# Altium schematic sheet CPCIS_Connectors.SchDoc
size 420 x 297 mm; SheetNumber: 3; SPICEModelCacheWWJYHNFZ: <root> / <DocumentId>WWJYHNFZ</DocumentId> / </root>; Title2: CPCIS_Connectors
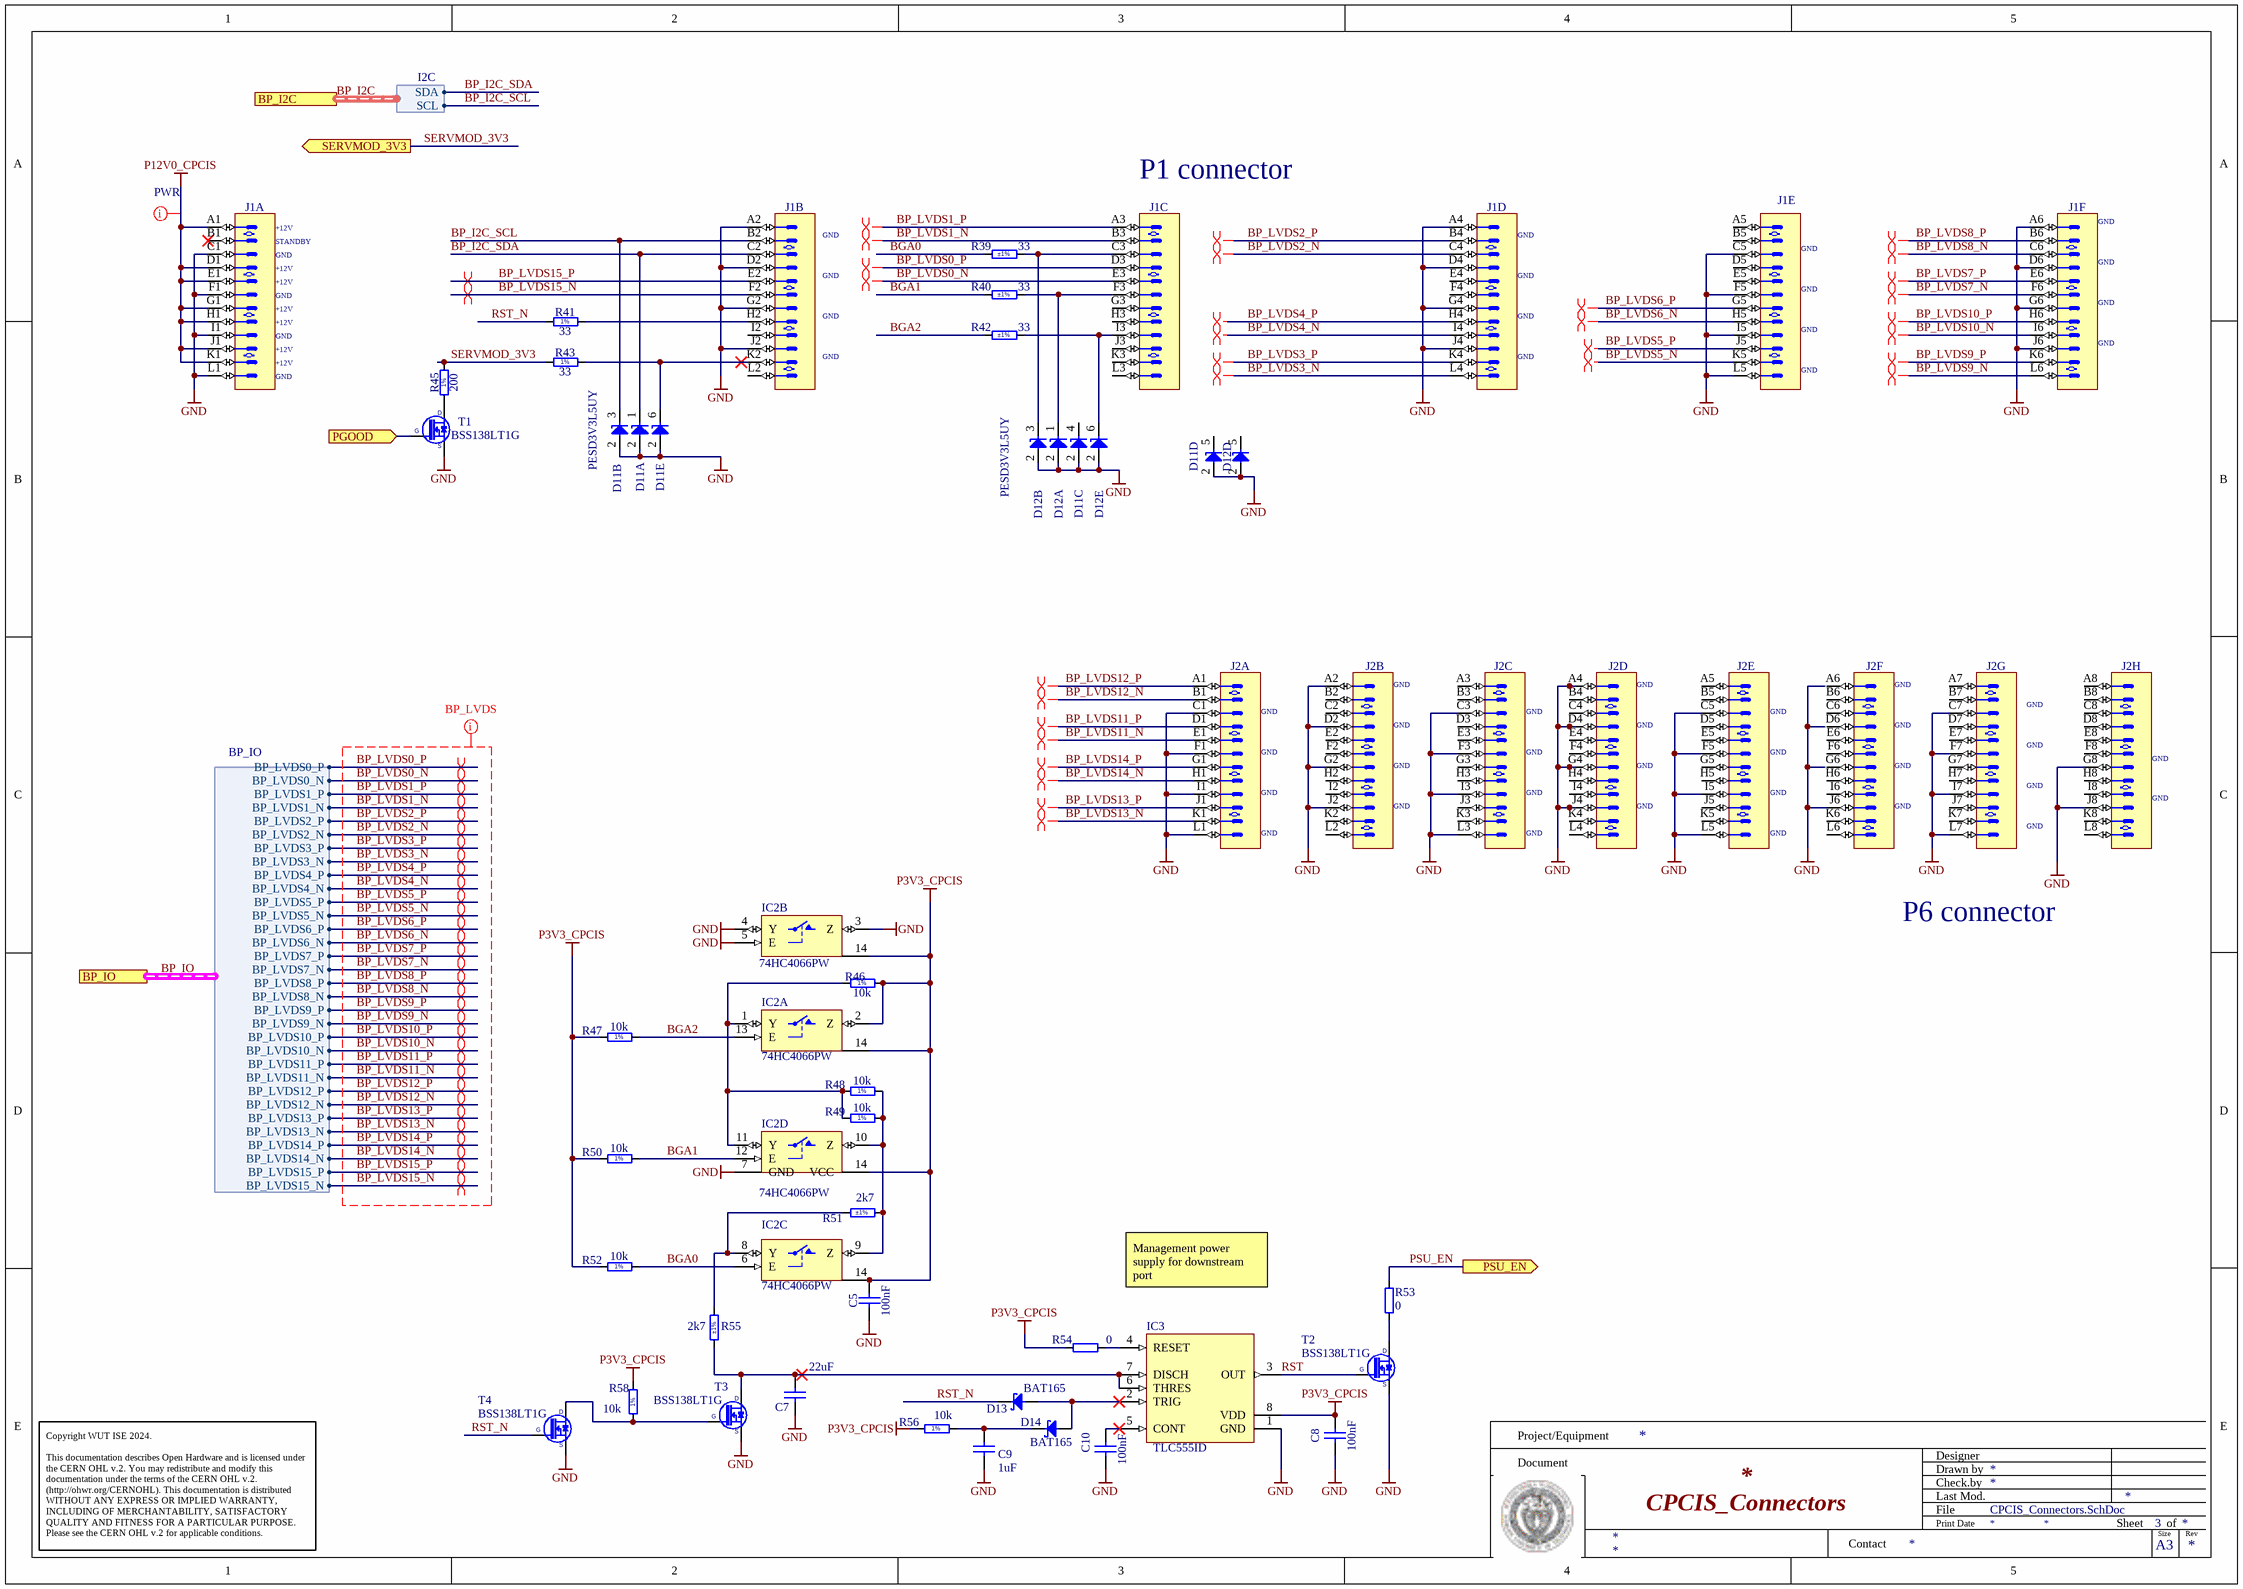
[diagram p0: CPCIS_Connectors.SchDoc]

## Parts
C5  100nF  [CAPC1005X55N]
C7  22uF  [CAPC2012X135N]
C8  100nF  [CAPC1005X55N]
C9  1uF  [CAPC1608X87N]
C10  100nF  [CAPC1005X55N]
D11  PESD3V3L5UY  [SOT65P210X110-6N]  (value not drawn)  (parts A,B,C,D,E of 5)
D12  PESD3V3L5UY  [SOT65P210X110-6N]  (value not drawn)  (parts A,B,D,E of 5)
D13  BAT165  [SOD2512X110N]
D14  BAT165  [SOD2512X110N]
IC2  74HC4066PW  [SOP65P640X110-14N]  (parts A,B,C,D of 4)
IC3  TLC555ID  [SOIC127P600X175-8N]
J1  (no value)  [AMPHENOL_10052825-101LF]  (parts A,B,C,D,E,F of 6)
J2  (no value)  [AMPHENOL_10052838-101LF]  (parts A,B,C,D,E,F,G,H of 8)
R39  33  Tolerance: ±1%  [RESC1608X55N]
R40  33  Tolerance: ±1%  [RESC1608X55N]
R41  33  Tolerance: 1%  [RESC1005X40N]
R42  33  Tolerance: ±1%  [RESC1608X55N]
R43  33  Tolerance: 1%  [RESC1005X40N]
R45  200  [RESC1005X40N]
R46  10k  [RESC1005X40N]
R47  10k  [RESC1005X40N]
R48  10k  [RESC1005X40N]
R49  10k  [RESC1005X40N]
R50  10k  [RESC1005X40N]
R51  2k7  Tolerance: ±1%  [RESC1608X55N]
R52  10k  [RESC1005X40N]
R53  0  [RESC1005X35N]
R54  0  [RESC1005X35N]
R55  2k7  Tolerance: ±1%  [RESC1608X55N]
R56  10k  [RESC1005X40N]
R58  10k  [RESC1005X40N]
T1  BSS138LT1G  [SOT95P240X110-3N]
T2  BSS138LT1G  [SOT95P240X110-3N]
T3  BSS138LT1G  [SOT95P240X110-3N]
T4  BSS138LT1G  [SOT95P240X110-3N]

## Ports
BP_I2C (harness I2C), BP_IO (harness BP_IO), PGOOD (in), PSU_EN (out), SERVMOD_3V3 (out)

## Harnesses
I2C: SDA, SCL
BP_IO: BP_LVDS0_P, BP_LVDS0_N, BP_LVDS1_P, BP_LVDS1_N, BP_LVDS2_P, BP_LVDS2_N, BP_LVDS3_P, BP_LVDS3_N, BP_LVDS4_P, BP_LVDS4_N, BP_LVDS5_P, BP_LVDS5_N, BP_LVDS6_P, BP_LVDS6_N, BP_LVDS7_P, BP_LVDS7_N, BP_LVDS8_P, BP_LVDS8_N, BP_LVDS9_P, BP_LVDS9_N, BP_LVDS10_P, BP_LVDS10_N, BP_LVDS11_P, BP_LVDS11_N, BP_LVDS12_P, BP_LVDS12_N, BP_LVDS13_P, BP_LVDS13_N, BP_LVDS14_P, BP_LVDS14_N, BP_LVDS15_P, BP_LVDS15_N

## Nets
GND: C5.1 C7.1 C8.1 C9.1 C10.1 D11.2(A) D12.2(A) IC2.3(Z) IC2.4(Y) IC2.5(E) IC2.7(GND) IC3.1(GND) J1.A2 J1.A4 J1.A6 J1.C1 J1.C5 J1.D2 J1.D4 J1.D6 J1.F1 J1.F5 J1.G2 J1.G4 J1.G6 J1.I1 J1.I5 J1.J2 J1.J4 J1.J6 J1.L1 J1.L5 J2.A2 J2.A4 J2.C1 J2.C3 J2.C5 J2.C7 J2.D2 J2.D4 J2.F1 J2.F3 J2.F5 J2.F7 J2.G2 J2.G4 J2.G8 J2.I1 J2.I3 J2.I5 J2.I7 J2.J2 J2.J4 J2.J6 J2.J8 J2.L1 J2.L3 J2.L5 J2.L7 T1.2(S) T2.2(S) T3.2(S) T4.2(S)
P3V3_CPCIS: C5.2 C8.2 IC2.2(Z) IC2.14(VCC) IC3.8(VDD) R46.2 R47.1 R50.1 R52.1 R54.2 R56.1 R58.2
P12V0_CPCIS: J1.A1 J1.D1 J1.E1 J1.G1 J1.H1 J1.J1 J1.K1
BGA0: IC2.6(E) R39.2 R52.2
BGA1: IC2.12(E) R40.2 R50.2
BGA2: IC2.13(E) R42.2 R47.2
BP_I2C_SCL: D11.3(C) J1.B2 ; port BP_I2C.SCL  [project net BP_I2C.SCL]
BP_I2C_SDA: D11.1(C) J1.C2 ; port BP_I2C.SDA  [project net BP_I2C.SDA]
BP_LVDS0_N: J1.E3 ; port BP_IO.BP_LVDS0_N  [project net BP_IO.BP_LVDS0_N]
BP_LVDS0_P: J1.D3 ; port BP_IO.BP_LVDS0_P  [project net BP_IO.BP_LVDS0_P]
BP_LVDS1_N: J1.B3 ; port BP_IO.BP_LVDS1_N  [project net BP_IO.BP_LVDS1_N]
BP_LVDS1_P: J1.A3 ; port BP_IO.BP_LVDS1_P  [project net BP_IO.BP_LVDS1_P]
BP_LVDS2_N: J1.C4 ; port BP_IO.BP_LVDS2_N  [project net BP_IO.BP_LVDS2_N]
BP_LVDS2_P: J1.B4 ; port BP_IO.BP_LVDS2_P  [project net BP_IO.BP_LVDS2_P]
BP_LVDS3_N: J1.L4 ; port BP_IO.BP_LVDS3_N  [project net BP_IO.BP_LVDS3_N]
BP_LVDS3_P: J1.K4 ; port BP_IO.BP_LVDS3_P  [project net BP_IO.BP_LVDS3_P]
BP_LVDS4_N: J1.I4 ; port BP_IO.BP_LVDS4_N  [project net BP_IO.BP_LVDS4_N]
BP_LVDS4_P: J1.H4 ; port BP_IO.BP_LVDS4_P  [project net BP_IO.BP_LVDS4_P]
BP_LVDS5_N: J1.K5 ; port BP_IO.BP_LVDS5_N  [project net BP_IO.BP_LVDS5_N]
BP_LVDS5_P: J1.J5 ; port BP_IO.BP_LVDS5_P  [project net BP_IO.BP_LVDS5_P]
BP_LVDS6_N: J1.H5 ; port BP_IO.BP_LVDS6_N  [project net BP_IO.BP_LVDS6_N]
BP_LVDS6_P: J1.G5 ; port BP_IO.BP_LVDS6_P  [project net BP_IO.BP_LVDS6_P]
BP_LVDS7_N: J1.F6 ; port BP_IO.BP_LVDS7_N  [project net BP_IO.BP_LVDS7_N]
BP_LVDS7_P: J1.E6 ; port BP_IO.BP_LVDS7_P  [project net BP_IO.BP_LVDS7_P]
BP_LVDS8_N: J1.C6 ; port BP_IO.BP_LVDS8_N  [project net BP_IO.BP_LVDS8_N]
BP_LVDS8_P: J1.B6 ; port BP_IO.BP_LVDS8_P  [project net BP_IO.BP_LVDS8_P]
BP_LVDS9_N: J1.L6 ; port BP_IO.BP_LVDS9_N  [project net BP_IO.BP_LVDS9_N]
BP_LVDS9_P: J1.K6 ; port BP_IO.BP_LVDS9_P  [project net BP_IO.BP_LVDS9_P]
BP_LVDS10_N: J1.I6 ; port BP_IO.BP_LVDS10_N  [project net BP_IO.BP_LVDS10_N]
BP_LVDS10_P: J1.H6 ; port BP_IO.BP_LVDS10_P  [project net BP_IO.BP_LVDS10_P]
BP_LVDS11_N: J2.E1 ; port BP_IO.BP_LVDS11_N  [project net BP_IO.BP_LVDS11_N]
BP_LVDS11_P: J2.D1 ; port BP_IO.BP_LVDS11_P  [project net BP_IO.BP_LVDS11_P]
BP_LVDS12_N: J2.B1 ; port BP_IO.BP_LVDS12_N  [project net BP_IO.BP_LVDS12_N]
BP_LVDS12_P: J2.A1 ; port BP_IO.BP_LVDS12_P  [project net BP_IO.BP_LVDS12_P]
BP_LVDS13_N: J2.K1 ; port BP_IO.BP_LVDS13_N  [project net BP_IO.BP_LVDS13_N]
BP_LVDS13_P: J2.J1 ; port BP_IO.BP_LVDS13_P  [project net BP_IO.BP_LVDS13_P]
BP_LVDS14_N: J2.H1 ; port BP_IO.BP_LVDS14_N  [project net BP_IO.BP_LVDS14_N]
BP_LVDS14_P: J2.G1 ; port BP_IO.BP_LVDS14_P  [project net BP_IO.BP_LVDS14_P]
BP_LVDS15_N: J1.F2 ; port BP_IO.BP_LVDS15_N  [project net BP_IO.BP_LVDS15_N]
BP_LVDS15_P: J1.E2 ; port BP_IO.BP_LVDS15_P  [project net BP_IO.BP_LVDS15_P]
PGOOD: T1.1(G) ; port PGOOD
PSU_EN: R53.1 ; port PSU_EN
RST: IC3.3(OUT) T2.1(G)
RST_N: D13.1(C) R41.1 T4.1(G)
SERVMOD_3V3: R43.1 R45.2 ; port SERVMOD_3V3
NetC7_2: C7.2 IC3.6(THRES) IC3.7(DISCH) R55.2 T3.3(D)
NetC9_2: C9.2 D14.1(C) R56.2
NetC10_2: C10.2 IC3.5(CONT)
NetD11_6: D11.6(C) J1.K2 R43.2
NetD12_1: D12.1(C) J1.F3 R40.1
NetD12_3: D12.3(C) J1.C3 R39.1
NetD12_6: D12.6(C) J1.I3 R42.1
NetD13_2: D13.2(A) D14.2(A) IC3.2(TRIG)
NetIC2_1: IC2.1(Y) IC2.11(Y) R46.1 R48.1 R49.1
NetIC2_8: IC2.8(Y) R51.1 R55.1
NetIC2_9: IC2.9(Z) IC2.10(Z) R48.2 R49.2 R51.2
NetIC3_4: IC3.4(RESET) R54.1
NetJ1_H2: J1.H2 R41.2
NetR45_1: R45.1 T1.3(D)
NetR53_2: R53.2 T2.3(D)
NetR58_1: R58.1 T3.1(G) T4.3(D)

Not connected (* = marked no-connect by the designer): D11 4(C) 5(C); D12 5(C); J1 A5 B1* B5 D5 E4 E5 F4 G3 H3 I2 J3 K3 L2 L3; J2 A3 A5 A6 A7 A8 B2 B3 B4 B5 B6 B7 B8 C2 C4 C6 C8 D3 D5 D6 D7 D8 E2 E3 E4 E5 E6 E7 E8 F2 F4 F6 F8 G3 G5 G6 G7 H2 H3 H4 H5 H6 H7 H8 I2 I4 I6 I8 J3 J5 J7 K2 K3 K4 K5 K6 K7 K8 L2 L4 L6 L8

## Buses and harness runs
harness BP_I2C = port BP_I2C
harness BP_IO = port BP_IO

## Layout directives
net class PWR: P12V0_CPCIS
differential pair: BP_IO.BP_LVDS0_N, BP_IO.BP_LVDS0_P, BP_IO.BP_LVDS1_N, BP_IO.BP_LVDS1_P, BP_IO.BP_LVDS2_N, BP_IO.BP_LVDS2_P, BP_IO.BP_LVDS3_N, BP_IO.BP_LVDS3_P, BP_IO.BP_LVDS4_N, BP_IO.BP_LVDS4_P, BP_IO.BP_LVDS5_N, BP_IO.BP_LVDS5_P, BP_IO.BP_LVDS6_N, BP_IO.BP_LVDS6_P, BP_IO.BP_LVDS7_N, BP_IO.BP_LVDS7_P, BP_IO.BP_LVDS8_N, BP_IO.BP_LVDS8_P, BP_IO.BP_LVDS9_N, BP_IO.BP_LVDS9_P, BP_IO.BP_LVDS10_N, BP_IO.BP_LVDS10_P, BP_IO.BP_LVDS11_N, BP_IO.BP_LVDS11_P, BP_IO.BP_LVDS12_N, BP_IO.BP_LVDS12_P, BP_IO.BP_LVDS13_N, BP_IO.BP_LVDS13_P, BP_IO.BP_LVDS14_N, BP_IO.BP_LVDS14_P, BP_IO.BP_LVDS15_N, BP_IO.BP_LVDS15_P
net class BP_LVDS: BP_LVDS0_N, BP_LVDS0_P, BP_LVDS1_N, BP_LVDS1_P, BP_LVDS2_N, BP_LVDS2_P, BP_LVDS3_N, BP_LVDS3_P, BP_LVDS4_N, BP_LVDS4_P, BP_LVDS5_N, BP_LVDS5_P, BP_LVDS6_N, BP_LVDS6_P, BP_LVDS7_N, BP_LVDS7_P, BP_LVDS8_N, BP_LVDS8_P, BP_LVDS9_N, BP_LVDS9_P, BP_LVDS10_N, BP_LVDS10_P, BP_LVDS11_N, BP_LVDS11_P, BP_LVDS12_N, BP_LVDS12_P, BP_LVDS13_N, BP_LVDS13_P, BP_LVDS14_N, BP_LVDS14_P, BP_LVDS15_N, BP_LVDS15_P

## Notes on the sheet
- (near J1) P1 connector
- (near J1) +12V
- (near J1) STANDBY
- (near J1) GND
- (near J2) GND
- P6 connector
- Management power supply for downstream port
- Project/Equipment
- Document
- Designer
- Drawn by
- Check.by
- Copyright WUT ISE 2024.
  This documentation describes Open Hardware and is licensed under the CERN OHL v.2. You may redistribute and modify this documentation under the terms of the CERN OHL v.2. (http://ohwr.org/CERNOHL). This documentation is distributed WITHOUT ANY EXPRESS OR IMPLIED WARRANTY, INCLUDING OF MERCHANTABILITY, SATISFACTORY QUALITY AND FITNESS FOR A PARTICULAR PURPOSE. Please see the CERN OHL v.2 for applicable conditions.
- Contact
- File
- Last Mod.
- Print Date
- Sheet
- Size
- A3
- of
- Rev
- (in symbol R0402_10K_1%_0.0625W_100PPM) 1%
- (in symbol R0402_200R_1%_0.0625W_100PPM) 1%

## Library data of the parts
C5 C8 C10 = CC0402_100NF_16V_10%_X5R: Non-polarised capacitor; Part Description: SMD Multilayer Chip Ceramic Capacitor; Manufacturer: GENERIC; Manufacturer1 Part Number: GRM155R61C104KA88D; Voltage: 16V; TC: X5R; Tolerance: ±10%; Part Number: CC0402_100NF_16V_10%_X5R; Component Kind: Standard; Component Type: Standard; Pin Count: 2; Value: 100nF; Status: None; Manufacturer Part Number: CC0402_100NF_16V_10%_X5R; Case: 0402; Mounted: Yes; Socket: No; SMD: Yes; Sense: No; Manufacturer1 Example: MURATA; Manufacturer1 ComponentHeight: 0.55mm; HelpURL: \\cern.ch\dfs\Applications\Altium\Datasheets\CC0402_X5R_MURATA_GRM.pdf; Author: CERN DEM JLC; CreateDate: 10.12.2013; LatestRevisionDate: 10.12.2013
C7 = CC0805_22UF_16V_10%_X5R: Non-polarised capacitor; Part Description: SMD Multilayer Chip Ceramic Capacitor; Manufacturer: GENERIC; Manufacturer1 Part Number: C2012X5R1C226KT; Voltage: 16V; TC: X5R; Tolerance: ±10%; Part Number: CC0805_22UF_16V_10%_X5R; Component Kind: Standard; Component Type: Standard; Pin Count: 2; Value: 22uF; Status: Preferred; Manufacturer Part Number: CC0805_22UF_16V_10%_X5R; Case: 0805; Mounted: Yes; Socket: No; SMD: Yes; Sense: No; Manufacturer1 Example: TDK; Manufacturer1 ComponentHeight: 1.35mm; HelpURL: \\cern.ch\dfs\Applications\Altium\Datasheets\CC0805_X5R_TDK_C.pdf; Author: CERN DEM JLC; CreateDate: 25.10.2012; LatestRevisionDate: 25.10.2012
C9 = CC0603_1UF_16V_10%_X7R: Non-polarised capacitor; Part Description: SMD Multilayer Chip Ceramic Capacitor; Manufacturer: GENERIC; Manufacturer1 Part Number: 223878615663; Voltage: 16V; TC: X7R; Tolerance: ±10%; Part Number: CC0603_1UF_16V_10%_X7R; Component Kind: Standard; Component Type: Standard; Pin Count: 2; Value: 1uF; Status: None; Manufacturer Part Number: CC0603_1UF_16V_10%_X7R; Case: 0603; Mounted: Yes; Socket: No; SMD: Yes; Sense: No; Manufacturer1 Example: YAGEO PHYCOMP; Manufacturer1 ComponentHeight: 0.9mm; HelpURL: \\cern.ch\dfs\Applications\Altium\Datasheets\CC0603_X7R_PHYCOMP.pdf; Author: CERN DEM JLC; CreateDate: 03.12.2007; LatestRevisionDate: 17.04.2015
D11 D12 = PESD3V3L5UY: Fivefold ESD Protection Diode Arrays; Part Description: Fivefold ESD Protection Diode Arrays (30kV); Manufacturer: NEXPERIA; Voltage: 3.3V; Power: 200W; PressFit: No; Bonding: No; Part Number: PESD3V3L5UY; Component Kind: Standard; Component Type: Standard; Device: PESD3V3L5UY; PackageDescription: SOT363, SC-88, 0.65mm Pitch; 6 Pin, 1.25mm W X 2.00mm L X 1.10mm H body, IPC Medium Density; Manufacturer Part Number: PESD3V3L5UY; Pin Count: 6; Case: SOT363; Mounted: Yes; Socket: No; SMD: Yes; Sense: No; ComponentHeight: 1.1mm; HelpURL: \\cern.ch\dfs\Applications\Altium\Datasheets\PESD3V3L5UY.pdf; Author: CERN DEM WB; CreateDate: 05.07.2021; LatestRevisionDate: 05.07.2021
D13 D14 = BAT165: Schottky Diode; Manufacturer: INFINEON; Part Description: Medium Power AF Schottky Diode; Voltage: 40V; Power: 750mA; PressFit: No; Bonding: No; Manufacturer Part Number: BAT165; PackageDescription: Small Outline Diode (SOD-323), 1.70mm W X 1.25mm L X 1.10mm H body,  IPC Medium Density; Part Number: BAT165; Component Kind: Standard; Component Type: Standard; Device: BAT165; Pin Count: 2; Case: SOD323; Mounted: Yes; Socket: No; SMD: Yes; Sense: No; ComponentHeight: 1.1mm; HelpURL: \\cern.ch\dfs\Applications\Altium\Datasheets\BAT165.pdf; Author: CERN DEM JLC; CreateDate: 12.11.2014; LatestRevisionDate: 12.11.2014
IC2 = 74HC4066PW: Part Description: Quad Single-Pole Single-Throw Analog Switch; Manufacturer: NXP SEMICONDUCTORS; PressFit: No; Bonding: No; Table: Standard Logic; Part Number: 74HC4066PW; Component Kind: Standard; Component Type: Standard; Device: 74HC4066PW; PackageDescription: SOP, 14-Leads, Body 4.4x5mm (max), Pitch 0.65mm, IPC Medium Density; Manufacturer Part Number: 74HC4066PW; Pin Count: 14; Case: TSSOP14; Mounted: Yes; Socket: No; SMD: Yes; ComponentHeight: 1.1mm; Author: CERN DEM JLC; HelpURL: \\cern.ch\dfs\Applications\Altium\Datasheets\74HC4066PW.pdf; CreateDate: 2014-11-19; LatestRevisionDate: 2014-11-19
IC3 = TLC555ID: LinCMOS Timer; Manufacturer: TEXAS INSTRUMENTS; PressFit: No; Bonding: No; Part Number: TLC555ID; Component Kind: Standard; Component Type: Standard; Device: TLC555ID; PackageDescription: SOIC 8, Pitch 1.27mm, Body 4x5mm, IPC Medium Density; Part Description: LinCMOS Timer; Manufacturer Part Number: TLC555ID; Pin Count: 8; Case: SOIC8; Mounted: Yes; Socket: No; SMD: Yes; Sense: No; ComponentHeight: 1.75mm; Author: CERN DEM JMW; HelpURL: \\cern.ch\dfs\Applications\Altium\Datasheets\TLC555ID.pdf; CreateDate: 23.08.2016; LatestRevisionDate: 23.08.2016
J1 = AMPHENOL_10052825-101LF: 72 Contacts Header, 6 Columns, 4 Pairs per Column
J2 = AMPHENOL_10052838-101LF: 96 Contacts Header, 8 Columns, 4 Pairs per Column
R39 R40 R42 = R0603_33R_1%_0.1W_100PPM: Resistor - 1%; Part Description: General Purpose Thick Film Chip Resistor; Manufacturer: GENERIC; Manufacturer1 Part Number: NRC06F33R0TRF; Power: 0.1W; TC: ±100ppm/°C; PressFit: No; Part Number: R0603_33R_1%_0.1W_100PPM; Component Kind: Standard; Component Type: Standard; Pin Count: 2; Value: 33; Status: Preferred; Manufacturer Part Number: R0603_33R_1%_0.1W_100PPM; Case: 0603; Mounted: Yes; Sense: No; Socket: No; SMD: Yes; Manufacturer1 Example: NIC COMPONENT; Manufacturer1 ComponentHeight: 0.55mm; HelpURL: \\cern.ch\dfs\Applications\Altium\Datasheets\R0603_NIC_NRC.pdf; Author: CERN DEM JLC; CreateDate: 03.12.2007; LatestRevisionDate: 13.03.2008
R41 R43 = Resistor - 1%
R45 = R0402_200R_1%_0.0625W_100PPM: Resistor - 1%; Part Description: General Purpose Thick Film Chip Resistor; Manufacturer: GENERIC; Manufacturer1 Part Number: 232270672001L; TC: ±100ppm/°C; PressFit: No; Part Number: R0402_200R_1%_0.0625W_100PPM; Component Kind: Standard; Component Type: Standard; Pin Count: 2; Value: 200; Status: Not Recommended; Power: 0.0625W; Tolerance: ±1%; Manufacturer Part Number: R0402_200R_1%_0.0625W_100PPM; Case: 0402; Mounted: Yes; Sense: No; Socket: No; SMD: Yes; Manufacturer1 Example: YAGEO PHYCOMP; Manufacturer1 ComponentHeight: 0.4mm; HelpURL: \\cern.ch\dfs\Applications\Altium\Datasheets\R0402_Phycomp_RC0402.pdf; Author: CERN DEM JLC; CreateDate: 2007-12-03; LatestRevisionDate: 2012-10-17
R46-R50 R52 R56 R58 = R0402_10K_1%_0.0625W_100PPM: Resistor - 1%; Part Description: General Purpose Thick Film Chip Resistor; Manufacturer: GENERIC; Manufacturer1 Part Number: 232270671003L; TC: ±100ppm/°C; Part Number: R0402_10K_1%_0.0625W_100PPM; Component Kind: Standard; Component Type: Standard; Pin Count: 2; Value: 10k; Status: Not recommended; Power: 0.0625W; Tolerance: ±1%; Manufacturer Part Number: R0402_10K_1%_0.0625W_100PPM; Case: 0402; Mounted: Yes; Sense: No; Socket: No; SMD: Yes; Manufacturer1 Example: YAGEO PHYCOMP; Manufacturer1 ComponentHeight: 0.4mm; HelpURL: \\cern.ch\dfs\Applications\Altium\Datasheets\R0402_Phycomp_RC0402.pdf; Author: CERN DEM JLC; CreateDate: 03.12.2007; LatestRevisionDate: 17.10.2012
R51 R55 = R0603_2K7_1%_0.1W_100PPM: Resistor - 1%; Part Description: General Purpose Thick Film Chip Resistor; Manufacturer: GENERIC; Manufacturer1 Part Number: RC0603FR-072K7L; Power: 0.1W; TC: ±100ppm/°C; PressFit: No; Part Number: R0603_2K7_1%_0.1W_100PPM; Component Kind: Standard; Component Type: Standard; Pin Count: 2; Value: 2k7; Status: Preferred; Manufacturer Part Number: R0603_2K7_1%_0.1W_100PPM; Case: 0603; Mounted: Yes; Sense: No; Socket: No; SMD: Yes; Manufacturer1 Example: YAGEO PHYCOMP; Manufacturer1 ComponentHeight: 0.55mm; HelpURL: \\cern.ch\dfs\Applications\Altium\Datasheets\R0603_PHYCOMP_RC0603.pdf; Author: CERN DEM JLC; CreateDate: 02.05.2011; LatestRevisionDate: 02.05.2011
R53 R54 = R0402_0R_JUMPER: Resistor; Part Description: 1A (0.05R Max DC Resistance) Zero Ohm Jumper; Manufacturer: GENERIC; Manufacturer1 Part Number: 232270591001L; Part Number: R0402_0R_JUMPER; Component Kind: Standard; Component Type: Standard; Footprint: RESC1005X40N; Pin Count: 2; Value: 0; Status: Not recommended; Manufacturer Part Number: R0402_0R_JUMPER; Case: 0402; Mounted: Yes; Sense: No; Socket: No; SMD: Yes; Manufacturer1 Example: YAGEO PHYCOMP; Manufacturer1 ComponentHeight: 0.4mm; HelpURL: \\cern.ch\dfs\Applications\Altium\Datasheets\R0402_Phycomp_RC0402.pdf; Author: CERN DEM JLC; CreateDate: 03.12.2007; LatestRevisionDate: 17.10.2012
T1-T4 = BSS138LT1G: N-CHANNEL MOSFET WITH DIODE; Part Description: 50V, 200mA N-Channel Enhancement Mode Field-Effect Transistor; Manufacturer: ON SEMICONDUCTOR; PressFit: No; Bonding: No; Part Number: BSS138LT1G; Component Kind: Standard; Component Type: Standard; Device: BSS138LT1G; PackageDescription: SOT23, 0.95mm Pitch; 3 Pin, 1.40mm W X 3.00mm L X 1.10mm H body, IPC Medium Density; Manufacturer Part Number: BSS138L; Pin Count: 3; Case: SOT23-3; Mounted: Yes; Socket: No; SMD: Yes; Sense: No; ComponentHeight: 1.11mm; HelpURL: \\cern.ch\dfs\Applications\Altium\Datasheets\BSS138LT1G.pdf; Author: CERN DEM JLC; CreateDate: 23.03.2009; LatestRevisionDate: 25.05.2022